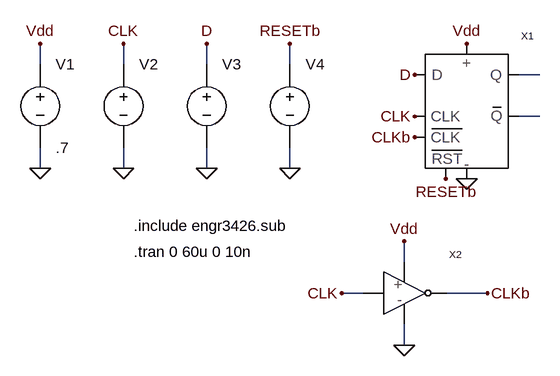
[diagram p0: schematic FlipFlop_test.asc]
FlipFlop_test.asc, the LTspice schematic file:
Version 4
SHEET 1 880 680
WIRE -464 80 -464 48
WIRE -336 80 -336 48
WIRE -208 80 -208 48
WIRE -80 80 -80 48
WIRE 304 96 272 96
WIRE 304 160 272 160
WIRE -464 240 -464 208
WIRE -336 240 -336 208
WIRE -208 240 -208 208
WIRE -80 240 -80 208
WIRE 96 384 96 352
WIRE 32 432 0 432
WIRE 224 432 160 432
WIRE 96 512 96 480
FLAG -464 240 0
FLAG -464 48 Vdd
FLAG -336 240 0
FLAG -336 48 CLK
FLAG -208 240 0
FLAG -208 48 D
FLAG 96 512 0
FLAG 96 352 Vdd
FLAG 0 432 CLK
FLAG 224 432 CLKb
FLAG 112 96 D
FLAG 112 160 CLK
FLAG 112 192 CLKb
FLAG 192 256 0
FLAG 192 48 Vdd
FLAG -80 240 0
FLAG -80 48 RESETb
FLAG 160 256 RESETb
SYMBOL cktsym\\vsource -464 144 R0
WINDOW 123 0 0 Left 2
WINDOW 39 0 0 Left 2
SYMATTR Value .7
SYMATTR InstName V1
SYMBOL cktsym\\vsource -336 144 R0
WINDOW 3 48 16 Invisible 2
WINDOW 123 0 0 Left 2
WINDOW 39 0 0 Left 2
SYMATTR Value PULSE(0 .7 5u 1n 1n 10u 20u)
SYMATTR InstName V2
SYMBOL cktsym\\vsource -208 144 R0
WINDOW 3 48 16 Invisible 2
WINDOW 123 0 0 Left 2
WINDOW 39 0 0 Left 2
SYMATTR Value PULSE(0 .7 0.5u 1n 1n 20u 40u)
SYMATTR InstName V3
SYMBOL Inverter 96 432 R0
SYMATTR InstName X2
SYMBOL cktsym\\vsource -80 144 R0
WINDOW 3 48 12 Invisible 2
WINDOW 123 0 0 Left 2
WINDOW 39 0 0 Left 2
SYMATTR Value PWL(0 .7 10u .7 10.05u 0 12u 0 12.05u .7 60u .7)
SYMATTR InstName V4
SYMBOL FlipFlop 192 160 R0
SYMATTR InstName X1
SYMATTR SpiceLine nmosL=0.9u nmosW=3u pmosL=0.9u pmosW=6u
TEXT -320 328 Left 2 !.include engr3426.sub
TEXT -320 368 Left 2 !.tran 0 60u 0 10n

The netlist it stands for:
* FlipFlop_test.asc
V1 Vdd 0 .7
V2 CLK 0 PULSE(0 .7 5u 1n 1n 10u 20u)
V3 D 0 PULSE(0 .7 0.5u 1n 1n 20u 40u)
XX2 CLK CLKb Vdd 0 Inverter  ; pins IN OUT pos neg
V4 RESETb 0 PWL(0 .7 10u .7 10.05u 0 12u 0 12.05u .7 60u .7)
XX1 D CLK CLKb N001 N002 RESETb Vdd 0 FlipFlop nmosL=0.9u nmosW=3u pmosL=0.9u pmosW=6u  ; pins D CLK CLKb Q Qb RESETb pos neg
.include engr3426.sub
.tran 0 60u 0 10n
.backanno
.end